# EasyEDA Pro project 智能视觉母版_V2.eprj, schematic 原理图_V2
Create Date: 2023-11-26; Page Name: P1; Project Name: 智能视觉母版_V2; Schematic Name: 原理图_V2; Update Date: 2023-11-29; Company: 嘉立创EDA; Page Size: A3; Version: V1.0
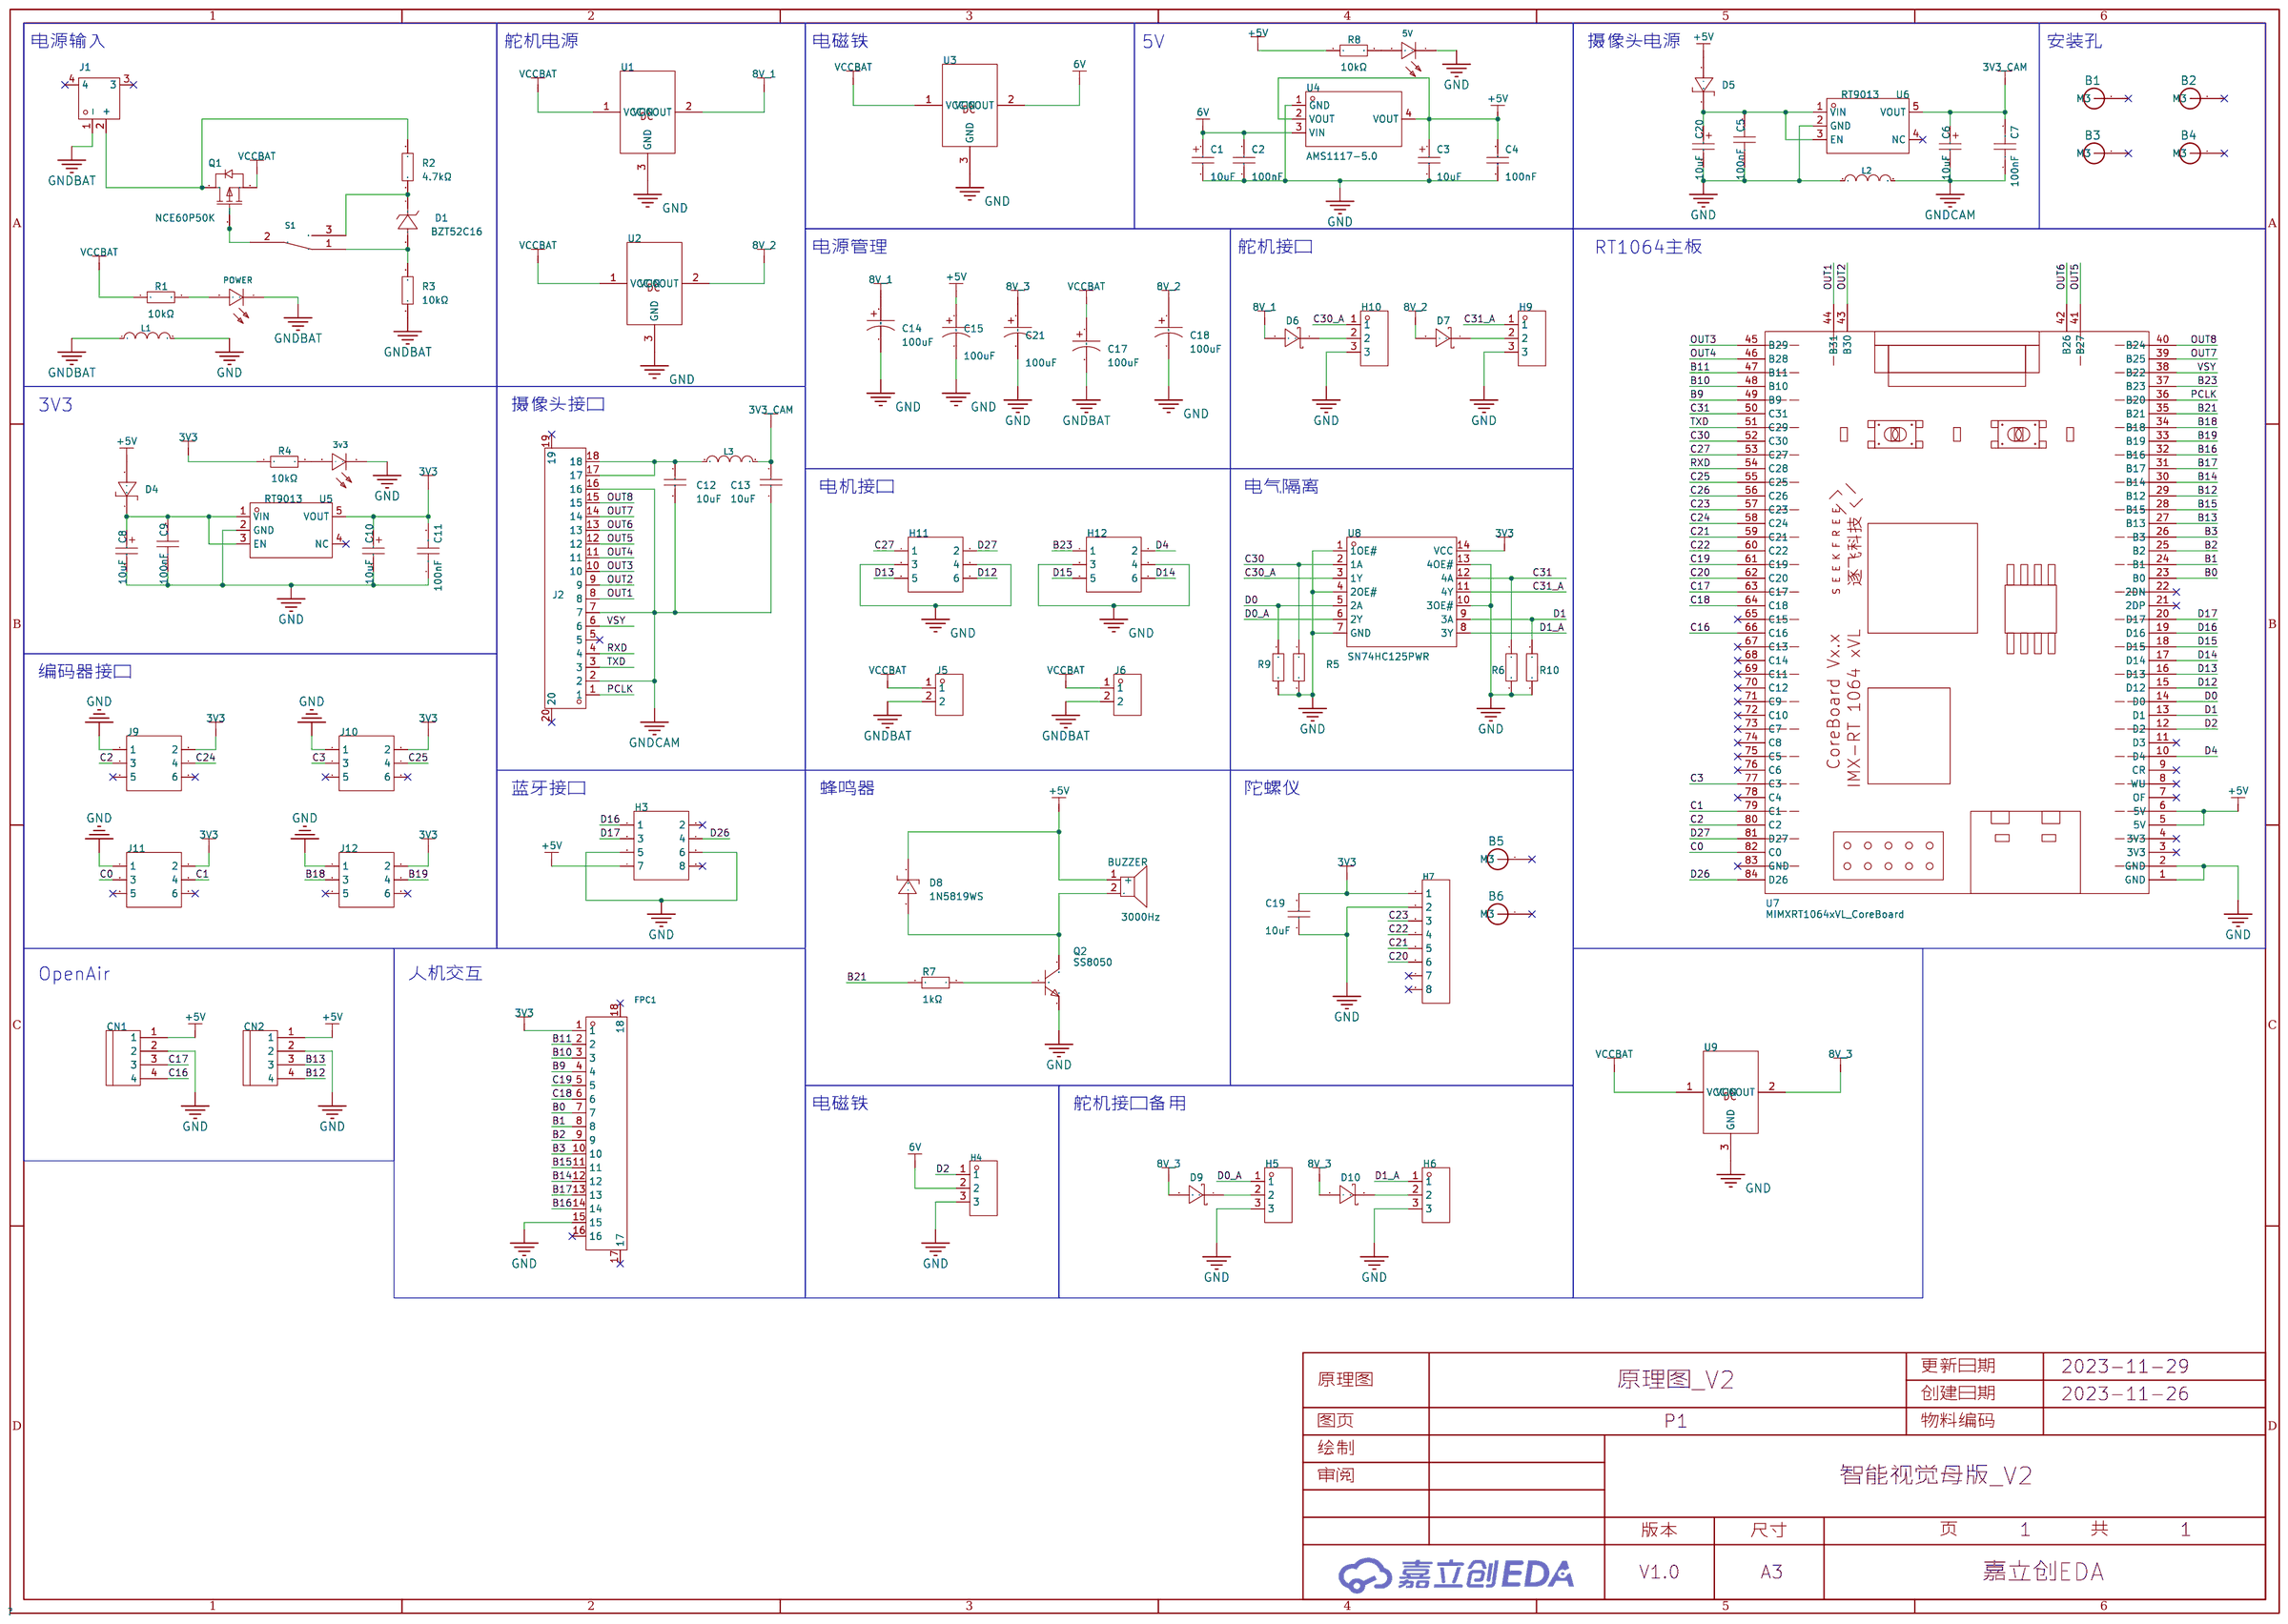
[diagram p0: schematic sheet]

## Parts
3v3  NCD0603W1  [LED0603-RD]
5V  NCD0603W1  [LED0603-RD]
B1  M3螺柱孔_JX  [M3]
B2  M3螺柱孔_JX  [M3]
B3  M3螺柱孔_JX  [M3]
B4  M3螺柱孔_JX  [M3]
B5  M3螺柱孔_JX  [M3]
B6  M3螺柱孔_JX  [M3]
BUZZER  3000Hz  [BUZ-TH_BD9.6-P5.00-D0.7-FD]
C1  10uF  [CAP-SMD_L3.2-W1.6-RD-C7171]
C2  100nF  [C0603]
C3  10uF  [CAP-SMD_L3.2-W1.6-RD-C7171]
C4  100nF  [C0603]
C5  100nF  [C0603]
C6  10uF  [CASE-A_3216]
C7  100nF  [C0603]
C8  10uF  [CASE-A_3216]
C9  100nF  [C0603]
C10  10uF  [CASE-A_3216]
C11  100nF  [C0603]
C12  10uF  [C0805]
C13  10uF  [C0805]
C14  100uF  [CAP-TH_BD8.0-P3.50-D0.6-FD]
C15  100uF  [CAP-TH_BD8.0-P3.50-D0.6-FD]
C17  100uF  [CAP-TH_BD8.0-P3.50-D0.6-FD]
C18  100uF  [CAP-TH_BD8.0-P3.50-D0.6-FD]
C19  10uF  [C0805]
C20  10uF  [CASE-A_3216]
C21  100uF  [CAP-TH_BD8.0-P3.50-D0.6-FD]
CN1  XH-4AW  [CONN-TH_XH2.54-4AW]
CN2  XH-4AW  [CONN-TH_XH2.54-4AW]
D1  BZT52C16  [SOD-123_L2.7-W1.6-LS3.7-RD]
D4  1N5819WS  [SOD-323_L1.8-W1.3-LS2.5-RD]
D5  1N5819WS  [SOD-323_L1.8-W1.3-LS2.5-RD]
D6  1N5819W  [SOD-123_L2.8-W1.8-LS3.7-RD]
D7  1N5819W  [SOD-123_L2.8-W1.8-LS3.7-RD]
D8  1N5819WS  [SOD-323_L1.8-W1.3-LS2.5-RD]
D9  1N5819W  [SOD-123_L2.8-W1.8-LS3.7-RD]
D10  1N5819W  [SOD-123_L2.8-W1.8-LS3.7-RD]
FPC1  FPC-05F-16PH20  [FPC-SMD_16P-P0.50_FPC-05F-16PH20]
H3  -  [HDR-TH_8P-P2.54-V-F-R2-C4-S2.54-1]
H4  -  [HDR-TH_3P-P2.54-V-F]
H5  -  [HDR-TH_3P-P2.54-V-M]
H6  -  [HDR-TH_3P-P2.54-V-M]
H7  -  [HDR-TH_8P-P2.54-V-F-1]
H9  -  [HDR-TH_3P-P2.54-V-M]
H10  -  [HDR-TH_3P-P2.54-V-M]
H11  -  [HDR-TH_6P-P2.54-V-R2-C3-S2.54_A2541WV-2X3P]
H12  -  [HDR-TH_6P-P2.54-V-R2-C3-S2.54_A2541WV-2X3P]
J1  XT60PW-M  [CONN-TH_XT60PW-M]
J2  J2  [FPC-SMD_18P-P0.50_FPC-05F-18PH20]
J5  KF301-5.0-2P  [CONN-TH_P5.00_KF301-5.0-2P]
J6  KF301-5.0-2P  [CONN-TH_P5.00_KF301-5.0-2P]
J9  -  [HDR-TH_6P-P2.54-V-R2-C3-S2.54_A2541WV-2X3P]
J10  -  [HDR-TH_6P-P2.54-V-R2-C3-S2.54_A2541WV-2X3P]
J11  -  [HDR-TH_6P-P2.54-V-R2-C3-S2.54_A2541WV-2X3P]
J12  -  [HDR-TH_6P-P2.54-V-R2-C3-S2.54_A2541WV-2X3P]
L1  CBG201209U000T  [L0805]
L2  CBG201209U000T  [L0805]
L3  CBG201209U000T  [L0805]
POWER  NCD0603R1  [LED0603-RD_RED]
Q1  NCE60P50K  [TO-252-2_L6.6-W6.1-P4.57-LS9.9-TL-CW]
Q2  SS8050  [SOT-23-3_L2.9-W1.3-P1.90-LS2.4-BR]
R1  10kΩ  [R0603]
R2  4.7kΩ  [R0603]
R3  10kΩ  [R0603]
R4  10kΩ  [R0603]
R5  10kΩ  [R0603]
R6  10kΩ  [R0603]
R7  1kΩ  [R0603]
R8  10kΩ  [R0603]
R9  10kΩ  [R0603]
R10  10kΩ  [R0603]
S1  MT-0-102-A101-M200-RS  [SW-TH_MT-0-103-A101-M200-RS]  (no BOM)
U1  -  [DC_Board]  (no BOM)
U2  -  [DC_Board]  (no BOM)
U3  -  [DC_Board]  (no BOM)
U4  AMS1117-5.0  [SOT-223_L6.5-W3.5-P2.30-LS7.0-BR]
U5  RT9013  [SOT-23-5_L2.9-W1.6-P0.95-LS2.8-BR]
U6  RT9013  [SOT-23-5_L2.9-W1.6-P0.95-LS2.8-BR]
U7  MIMXRT1064xVL_CoreBoard  [MIMXRT1064xVL_CoreBoard - 3D]
U8  SN74HC125PWR  [TSSOP-14_L5.0-W4.4-P0.65-LS6.5-BL]
U9  -  [DC_Board]  (no BOM)

## Library data of the parts
3v3 5V = NCD0603W1: 发光颜色:白灯;; LCSC Part Name: 白灯 0603白灯   正贴; Supplier Part: C84265; Manufacturer: 国星光电; Supplier Footprint: 0603; JLCPCB Part Class: Extended Part; Datasheet: https://atta.szlcsc.com/upload/public/pdf/source/20200820/C84265_479E6193713348A548E5CD6D9278BF16.pdf; Supplier: LCSC; Emitted Color: 白灯
B1-B6 = M3螺柱孔_JX
BUZZER = HNB09A05: 驱动方式:有源(内含驱动线路);构造类型:电磁式;额定电压:5V;工作电压:4V~8V;频率:3000Hz;声压(SPL):85dB@5V,10cm;直径(φD):9mm;高度:5.7mm;; Supplier Part: C96493; Manufacturer: 华能; Supplier Footprint: 插件; JLCPCB Part Class: 扩展库; Datasheet: https://atta.szlcsc.com/upload/public/pdf/source/20170522/1495448327549.pdf; Supplier: LCSC; Oscillator Circuit: 有源(内含驱动线路); Technology Type: 电磁式; Rated Voltage: 5V; Operating Voltage: 4V~8V; Sound Pressure Level (SPL): 85dB@5V,10cm; Diameter (φD): 9mm; Height: 5.7mm
C1 C3 = TAJA106K016RNJ: 容值:10uF;精度:±10%;额定电压:16V;等效串联电阻:3Ω@100kHz;; LCSC Part Name: 10uF ±10% 16V; Supplier Part: C7171; Manufacturer: Kyocera AVX; Supplier Footprint: CASE-A-3216; JLCPCB Part Class: 基础库; Datasheet: https://atta.szlcsc.com/upload/public/pdf/source/20160107/1457707748093.pdf; Supplier: LCSC; Tolerance: ±10%; Rated Voltage: 16V; Equivalent Series Resistance(ESR): 3Ω@100kHz; Operating Temperature: -55℃~+125℃
C2 C4 = 0603B104K500NT: 容值:100nF;精度:±10%;额定电压:50V;材质(温度系数):X7R;; LCSC Part Name: 100nF ±10% 50V; Supplier Part: C30926; Manufacturer: FH(风华); Supplier Footprint: 0603; JLCPCB Part Class: Extended Part; Datasheet: https://atta.szlcsc.com/upload/public/pdf/source/20170923/C30926_1506149436298988724.pdf; Supplier: LCSC; Tolerance: ±10%; Voltage Rated: 50V; Temperature Coefficient: X7R
C5 C7 C9 C11 = CAP_0603: Supplier Footprint: 0603
C6 C8 C10 C20 = CA45-A-10V-10uF-M: 容值:10uF;精度:±20%;额定电压:10V;等效串联电阻:8Ω@100kHz;工作温度:-55~+125;; LCSC Part Name: 10uF ±20% 10V; Supplier Part: C128256; Manufacturer: CEC(振华新云); JLCPCB Part Class: Extended Part; Datasheet: https://atta.szlcsc.com/upload/public/pdf/source/20171113/C128256_15105610660201115413.pdf; Supplier: LCSC; Tolerance: ±20%; Rated Voltage: 10V; Equivalent Series Resistance(ESR): 8Ω@100kHz; Operating Temperature: -55~+125
C12 C13 C19 = CL21A106KAYNNNE_C15850: 容值:10uF;精度:±10%;额定电压:25V;材质(温度系数):X5R;; LCSC Part Name: 10uF ±10% 25V; Supplier Part: C15850; Manufacturer: SAMSUNG(三星); Manufacturer Part: CL21A106KAYNNNE; Supplier Footprint: 0805; JLCPCB Part Class: 基础库; Datasheet: https://atta.szlcsc.com/upload/public/pdf/source/20160103/1457707679302.pdf; Supplier: LCSC; Tolerance: ±10%; Voltage Rated: 25V; Temperature Coefficient: X5R
C14 C15 C17 C18 C21 = 25PZE220M8X9: 类型:混合物;容值:220uF;精度:±20%;额定电压:25V;电容体直径:8mm;电容体长度:9mm;脚间距:-;纹波电流:2.3A@100kHz;等效串联电阻:27mΩ@100kHz;工作寿命:10000hrs@105℃;工作温度:-55℃~+105℃;; LCSC Part Name: 220uF ±20% 25V; Supplier Part: C1578758; Manufacturer: rubycon(红宝石); Supplier Footprint: 径向引线,8x9mm; JLCPCB Part Class: Extended Part; Datasheet: https://atta.szlcsc.com/upload/public/pdf/source/20210510/C1578758_E2F1F56A0A42A1F170EC582F74BCA115.pdf; Supplier: LCSC; Type: 混合物; Tolerance: ±20%; Rated Voltage: 25V; φD: 8mm; L: 9mm; Ripple Current: 2.3A@100kHz; Equivalent Series Resistance(ESR): 27mΩ@100kHz; Lifetime @ Temp: 10000hrs@105℃; Operating Temperature: -55℃~+105℃
CN1 CN2 = XH-4AW_C21273: 参考系列:XH;间距:2.5mm;插针结构:1x4P;排数:1;每排PIN数:4;行距:-;安装方式:-;触头材质:磷青铜;; LCSC Part Name: 系列:XH 间距:2.5mm 1x4P 卧插; Supplier Part: C21273; Manufacturer: BOOMELE(博穆精密); Supplier Footprint: 弯插,P=2.5mm; JLCPCB Part Class: Extended Part; Datasheet: https://atta.szlcsc.com/upload/public/pdf/source/20181205/C146112_2CB31444E6250AC61E2A41A9A8391D5F.pdf; Supplier: LCSC; Reference Series: XH; Pitch: 2.5mm; Pins Structure: 1x4P; Number of Rows: 1; Number of PINs Per Row: 4; Contact Material: 磷青铜
D1 = BZT52C16: 稳压值(标称值):-;精度:-;功率:500mW;反向电流(Ir):100nA@11.2V;; LCSC Part Name: 500mW; Supplier Part: C707145; Manufacturer: Slkor(萨科微); Supplier Footprint: SOD-123; JLCPCB Part Class: 扩展库; Datasheet: https://atta.szlcsc.com/upload/public/pdf/source/20200721/C707125_BAEA70ACC1B0F60BBAC1FD71D8806D24.pdf; Supplier: LCSC; Power Dissipation: 500mW; Reverse Leakage Current (Ir): 100nA@11.2V
D4 D5 D8 = 1N5819WS_C191023: 直流反向耐压(Vr):40V;平均整流电流(Io):1A;正向压降(Vf):600mV@1A;; LCSC Part Name: 40V 1A 600mV@1A; Supplier Part: C191023; Manufacturer: Hottech(合科泰); Supplier Footprint: SOD-323; JLCPCB Part Class: 基础库; Datasheet: https://atta.szlcsc.com/upload/public/pdf/source/20220428/3CB86FD8D28D653594B4E35F9D5AEFD9.pdf; Supplier: LCSC; Reverse Voltage (Vr): 40V; Average Rectified Current (Io): 1A; Forward Voltage (Vf@If): 600mV@1A
D6 D7 D9 D10 = 1N5819W_C369930: 正向压降(Vf):600mV@1A;直流反向耐压(Vr):40V;平均整流电流(Io):1A;; LCSC Part Name: 电压:40V 电流:1A; Supplier Part: C369930; Manufacturer: KEXIN(科信); Supplier Footprint: SOD-123FL; JLCPCB Part Class: Extended Part; Datasheet: https://atta.szlcsc.com/upload/public/pdf/source/20190226/C369930_913B46064935EAA2DC128976F7CDE656.pdf; Supplier: LCSC; Forward Voltage (Vf@If): 600mV@1A; Reverse Voltage (Vr): 40V; Average Rectified Current (Io): 1A
FPC1 = FPC-05F-16PH20: 间距:0.5mm;触点数量:16P;锁定特性:翻盖式;安装类型:卧贴;触点类型:下接;工作温度范围:-25℃~+85℃;; LCSC Part Name: 0.5mm P数:16P 翻盖式 下接; Supplier Part: C2856801; Manufacturer: XUNPU(讯普); Supplier Footprint: SMD,P=0.5mm; JLCPCB Part Class: Extended Part; Datasheet: https://atta.szlcsc.com/upload/public/pdf/source/20210922/C2856801_73A554E58C5577257FCEC843978D3BA6.pdf; Supplier: LCSC; Pitch: 0.5mm; Number of Contacts: 16P; Locking Feature: 翻盖式; Mounting Type: 卧贴; Contact Type: 下接; Height Above Board: 2mm; FFC, FCB Thickness: 0.3mm; Operating Temperature Range: -25℃~+85℃
H3 = HDR-F_2.54_2x4: Supplier Part: C92271; Supplier Footprint: 插件
H4 = HDR-F_2.54_1x3P: Supplier Part: C541850; Supplier Footprint: 插件
H5 H6 H9 H10 = HDR-M_2.54_1x3P: Supplier Part: C2937625; Supplier Footprint: 插件
H7 = HDR-F_2.54_1x8P: Supplier Part: C27438; Supplier Footprint: 插件
H11 H12 J9-J12 = HDR-M_2.54_2x3: Supplier Part: C402781; Supplier Footprint: 插件,P=2.54mm
J1 = XT60PW-M: 模型锂电连接器; LCSC Part Name: AMASS(艾迈斯)航模插头xt90连接器150公母对接pw锂电池公头 板插卧式XT60PW-M; Supplier Part: C98732; Manufacturer: AMASS(艾迈斯); JLCPCB Part Class: 扩展库; Datasheet: https://atta.szlcsc.com/upload/public/pdf/source/20180125/C98732_15168617837851301983.pdf; Supplier: LCSC
J2 = FPC-05F-18PH20: 间距:0.5mm;触点数量:18P;锁定特性:翻盖式;安装类型:卧贴;触点类型:下接;工作温度范围:-25℃~+85℃;; LCSC Part Name: 0.5mm P数:18P 翻盖式 下接; Supplier Part: C2856802; Manufacturer: XUNPU(讯普); Supplier Footprint: SMD,P=0.5mm; JLCPCB Part Class: Extended Part; Datasheet: https://atta.szlcsc.com/upload/public/pdf/source/20210922/C2856802_2A845D1961F33AEC1ED22CECB292335F.pdf; Supplier: LCSC; Pitch: 0.5mm; Number of Contacts: 18P; Locking Feature: 翻盖式; Mounting Type: 卧贴; Contact Type: 下接; Height Above Board: 2mm; FFC, FCB Thickness: 0.3mm; Operating Temperature Range: -25℃~+85℃
J5 J6 = KF301-5.0-2P: 间距:5mm;排数:1;每排PIN数:2;安装方式:直针;额定电流:17A;额定电压:250V;线规 - AWG:14~22;线规 - mm?:1.5;工作温度范围:-30℃~+120℃;颜色:蓝色;; LCSC Part Name: 5mm 排数:1 每排P数:2 直针 可拼接 铜 环保; Supplier Part: C474881; Manufacturer: KEFA(科发); Supplier Footprint: 直插,P=5mm; JLCPCB Part Class: Extended Part; Datasheet: https://atta.szlcsc.com/upload/public/pdf/source/20200115/C474881_883EFE2003339C40FD1BEEEFC9A18423.pdf; Supplier: LCSC; Pitch: 5mm; Number of Rows: 1; Number of PINs Per Row: 2; Mounting Style: 直针; Current Rating (Max): 17A; Voltage Rating (Max): 250V; Wire Gauge - AWG: 14~22; Wire Gauge - mm?: 1.5; Operating Temperature Range: -30℃~+120℃; Color: 蓝色
L1-L3 = CBG201209U000T: 标称阻抗@测试频率:0Ω@100MHz;直流电阻(RDC):80mΩ;; LCSC Part Name: 单路 0805磁珠 阻抗0Ω@100MHz; Supplier Part: C91037; Manufacturer: FH(风华); Supplier Footprint: 0805; JLCPCB Part Class: 扩展库; Datasheet: https://atta.szlcsc.com/upload/public/pdf/source/20161217/1481939213023.pdf; Supplier: LCSC; Impedance @ Frequency: 0Ω@100MHz; DC Resistance: 80mΩ; Current Rating: 900mA; Circuits: 1
POWER = NCD0603R1_C84263: 发光颜色:红灯;; LCSC Part Name: 红灯 0603红灯   正贴; Supplier Part: C84263; Manufacturer: 国星光电; Supplier Footprint: 0603; JLCPCB Part Class: Extended Part; Datasheet: https://atta.szlcsc.com/upload/public/pdf/source/20200820/C84263_DABC6A75E58F576973B407FDBA283D60.pdf; Supplier: LCSC; Emitted Color: 红灯
Q1 = NCE60P50K: 类型:P沟道;漏源电压(Vdss):60V;连续漏极电流(Id):50A;功率(Pd):95W;导通电阻(RDS(on)@Vgs,Id):23mΩ@10V,20A;阈值电压(Vgs(th)@Id):3.5V@250uA;; LCSC Part Name: P沟道 60V 50A; Supplier Part: C130104; Manufacturer: NCE(无锡新洁能); Supplier Footprint: TO-252-2(DPAK); JLCPCB Part Class: 扩展库; Datasheet: https://atta.szlcsc.com/upload/public/pdf/source/20170919/C130104_1505787180031976877.pdf; Supplier: LCSC; Type: P沟道; Drain Source Voltage (Vdss): 60V; Continuous Drain Current (Id): 50A; Power Dissipation (Pd): 95W; Drain Source On Resistance (RDS(on)@Vgs,Id): 23mΩ@10V,20A; Gate Threshold Voltage (Vgs(th)@Id): 3.5V@250uA
Q2 = SS8050_C2150: 晶体管类型:NPN;集射极击穿电压(Vceo):25V;集电极电流(Ic):1.5A;功率(Pd):300mW;直流电流增益(hFE@Ic,Vce):200@100mA,1V;; LCSC Part Name: NPN 25V 1.5A Y1 200-350; Supplier Part: C2150; Manufacturer: CJ(江苏长电/长晶); Supplier Footprint: SOT-23; JLCPCB Part Class: 基础库; Datasheet: https://atta.szlcsc.com/upload/public/pdf/source/20230322/AEE86F4B043774EFF80CAEA14A37D9E9.pdf; Supplier: LCSC; Transistor Type: NPN; Collector-Emitter Breakdown Voltage (Vceo): 25V; Collector Current (Ic): 1.5A; Power Dissipation (Pd): 300mW; Collector Cut-Off Current (Icbo): 100nA; Collector-Emitter Saturation Voltage (VCE(sat)@Ic,Ib): 500mV@800mA,80mA; DC Current Gain (hFE@Ic,Vce): 200@100mA,1V; Transition Frequency (fT): 100MHz; Operating Temperature: +150℃@(Tj)
R1 R3-R6 R8-R10 = 0603WAF1002T5E: 电阻类型:厚膜电阻;阻值:10kΩ;精度:±1%;功率:100mW;; LCSC Part Name: 厚膜电阻 10kΩ ±1% 100mW; Supplier Part: C25804; Manufacturer: UNI-ROYAL(厚声); Supplier Footprint: 0603; JLCPCB Part Class: 基础库; Datasheet: https://atta.szlcsc.com/upload/public/pdf/source/20200306/C422600_1E6D84923E4A46A82E41ADD87F860B5C.pdf; Supplier: LCSC; Type: 厚膜电阻; Tolerance: ±1%; Power(Watts): 100mW; Temperature Coefficient: ±100ppm/℃; Overload Voltage (Max): 75V; Operating Temperature Range: -55℃~+155℃
R2 = 0603WAF4701T5E: 电阻类型:厚膜电阻;阻值:4.7kΩ;精度:±1%;功率:100mW;; LCSC Part Name: 4.7kΩ ±1% 100mW; Supplier Part: C23162; Manufacturer: UNI-ROYAL(厚声); Supplier Footprint: 0603; JLCPCB Part Class: Basic Part; Datasheet: https://atta.szlcsc.com/upload/public/pdf/source/20200306/C422600_1E6D84923E4A46A82E41ADD87F860B5C.pdf; Supplier: LCSC; Type: 厚膜电阻; Tolerance: ±1%; Power(Watts): 100mW; Temperature Coefficient: ±100ppm/℃; Overload Voltage (Max): 75V; Operating Temperature Range: -55℃~+155℃
R7 = 0603WAF1001T5E: 电阻类型:厚膜电阻;阻值:1kΩ;精度:±1%;功率:100mW;; LCSC Part Name: 1kΩ ±1% 100mW; Supplier Part: C21190; Manufacturer: UNI-ROYAL(厚声); Supplier Footprint: 0603; JLCPCB Part Class: Basic Part; Datasheet: https://atta.szlcsc.com/upload/public/pdf/source/20200306/C422600_1E6D84923E4A46A82E41ADD87F860B5C.pdf; Supplier: LCSC; Type: 厚膜电阻; Tolerance: ±1%; Power(Watts): 100mW; Temperature Coefficient: ±100ppm/℃; Overload Voltage (Max): 75V; Operating Temperature Range: -55℃~+155℃
S1 = MT-0-102-A101-M200-RS: 额定电流:5A;额定电压(AC):125V;电路结构:单刀双掷;机械寿命:-;安装方式:直插;; LCSC Part Name: 小型钮子三脚二档 二件套 含配件; Supplier Part: C1788492; Manufacturer: YUEN FUNG(源丰); Supplier Footprint: 插件; JLCPCB Part Class: 扩展库; Datasheet: https://atta.szlcsc.com/upload/public/pdf/source/20230720/8E5C36EFDF374AE4FF4AC09DB233CE0E.pdf; Supplier: LCSC; Contact Current: 5A; Voltage Rating (AC): 125V; Circuit: 单刀双掷; Actuator Type: 圆柱钮柄; Pin Style: 焊片; Mounting Style: 直插; Operating Temperature: -25℃~+85℃; Switch Length: 13mm; Switch Width: 8mm; Switch Height: 28.6mm
U1-U3 U9 = DC_Board
U4 = AMS1117-5.0_C6187: 输出类型:固定;最大输入电压:12V;输出电压:5V;输出电流:1A;电源纹波抑制比(PSRR):68dB@(120Hz);输出极性:正;; LCSC Part Name: 输入12V 输出5V 1A; Supplier Part: C6187; Manufacturer: AMS; Supplier Footprint: SOT-223; JLCPCB Part Class: 基础库; Datasheet: https://atta.szlcsc.com/upload/public/pdf/source/20230918/E4B716057EE82179D88E8A0894830D59.pdf; Supplier: LCSC; Output Type: 固定; Maximum Input Voltage: 12V; Output Voltage: 5V; Output Current: 1A; Power Supply Rejection Ratio (PSRR): 68dB@(120Hz); Dropout Voltage: 1.3V@(1A); Output Polarity: 正; Number of Outputs: 1
U5 U6 = RT9013-30GB: LCSC Part Name: CMOS LDO Regulator; Supplier Part: C3031664; Manufacturer: RICHTEK(台湾立锜); Supplier Footprint: SOT-23-5; Datasheet: https://atta.szlcsc.com/upload/public/pdf/source/20151126/1457707591671.pdf; Supplier: LCSC
U7 = MIMXRT1064xVL_CoreBoard
U8 = SN74HC125PWR: 类型:缓冲器，非反相;电源电压:2V~6V;输入类型:-;输出类型:三态;低电平输出电流(IOL):7.8mA;高电平输出电流(IOH):7.8mA;工作温度:-40℃~+85℃;; Supplier Part: C132994; Manufacturer: TI(德州仪器); Supplier Footprint: TSSOP-14; JLCPCB Part Class: Extended Part; Datasheet: https://atta.szlcsc.com/upload/public/pdf/source/20170930/C132994_1506736365150997346.pdf; Supplier: LCSC; Type: 缓冲器，非反相; Supply Voltage: 2V~6V; output type: 三态; Current-OutputLow: 7.8mA; Current-OutputHigh: 7.8mA; Operating temperature: -40℃~+85℃

## Nets
3V3: C10.1 C11.2 C19.2 FPC1.1 H7.1 J9.2 J10.2 J11.2 J12.2 R4.1 U5.5(VOUT) U8.14(VCC)
3V3_CAM: C6.1 C7.2 C13.2 L3.2 U6.5(VOUT)
6V: C1.1 C2.2 H4.2 U3.2(VCCOUT) U4.3(VIN)
8V_1: C14.1 D6.2(A) U1.2(VCCOUT)
8V_2: C18.1 D7.2(A) U2.2(VCCOUT)
8V_3: C21.1 D9.2(A) D10.2(A) U9.2(VCCOUT)
+5V: BUZZER.1(+) C3.1 C4.2 C15.1 CN1.1 CN2.1 D4.2(A) D5.2(A) D8.1(C) H3.7 R8.1 U4.2(VOUT) U4.4(VOUT) U7.5(5V) U7.6(5V)
GND: 3v3.1(-) 5V.1(-) C1.2 C2.1 C3.2 C4.1 C5.1 C8.2 C9.1 C10.2 C11.1 C14.2 C15.2 C18.2 C19.1 C20.2 C21.2 CN1.2 CN2.2 FPC1.15 H3.5 H3.6 H4.3 H5.3 H6.3 H7.2 H9.3 H10.3 H11.3 H11.4 H12.3 H12.4 J9.1 J10.1 J11.1 J12.1 L1.2 L2.1 Q2.2(E) R5.2 R6.2 R9.2 R10.2 U1.3(GND) U2.3(GND) U3.3(GND) U4.1(GND) U5.2(GND) U6.2(GND) U7.1(GND) U7.2(GND) U8.1(1OE#) U8.4(2OE#) U8.7(GND) U8.10(3OE#) U8.13(4OE#) U9.3(GND)
GNDBAT: C17.2 J1.1(-) J5.2 J6.2 L1.1 POWER.1(K) R3.2
GNDCAM: C6.2 C7.1 C12.1 C13.1 J2.2 J2.7 J2.16 L2.2
VCCBAT: C17.1 J5.1 J6.1 Q1.2(D) R1.1 U1.1(VCCIN) U2.1(VCCIN) U3.1(VCCIN) U9.1(VCCIN)
B0: FPC1.7 U7.23(B0)
B1: FPC1.8 U7.24(B1)
B2: FPC1.9 U7.25(B2)
B3: FPC1.10 U7.26(B3)
B9: FPC1.4 U7.49(B9)
B10: FPC1.3 U7.48(B10)
B11: FPC1.2 U7.47(B11)
B12: CN2.4 U7.29(B12)
B13: CN2.3 U7.27(B13)
B14: FPC1.12 U7.30(B14)
B15: FPC1.11 U7.28(B15)
B16: FPC1.14 U7.32(B16)
B17: FPC1.13 U7.31(B17)
B18: J12.3 U7.34(B18)
B19: J12.4 U7.33(B19)
B21: R7.1 U7.35(B21)
B23: H12.1 U7.37(B23)
C0: J11.3 U7.82(C0)
C1: J11.4 U7.79(C1)
C2: J9.3 U7.80(C2)
C3: J10.3 U7.77(C3)
C16: CN1.4 U7.66(C16)
C17: CN1.3 U7.63(C17)
C18: FPC1.6 U7.64(C18)
C19: FPC1.5 U7.61(C19)
C20: H7.6 U7.62(C20)
C21: H7.5 U7.59(C21)
C22: H7.4 U7.60(C22)
C23: H7.3 U7.57(C23)
C24: J9.4 U7.58(C24)
C25: J10.4 U7.55(C25)
C26: U7.56(C26)
C27: H11.1 U7.53(C27)
C30: R5.1 U7.52(C30) U8.2(1A)
C30_A: H10.1 U8.3(1Y)
C31: R6.1 U7.50(C31) U8.12(4A)
C31_A: H9.1 U8.11(4Y)
D0: R9.1 U7.14(D0) U8.5(2A)
D0_A: H5.1 U8.6(2Y)
D1: R10.1 U7.13(D1) U8.9(3A)
D1_A: H6.1 U8.8(3Y)
D2: H4.1 U7.12(D2)
D4: H12.2 U7.10(D4)
D12: H11.6 U7.15(D12)
D13: H11.5 U7.16(D13)
D14: H12.6 U7.17(D14)
D15: H12.5 U7.18(D15)
D16: H3.1 U7.19(D16)
D17: H3.3 U7.20(D17)
D26: H3.4 U7.84(D26)
D27: H11.2 U7.81(D27)
OUT1: J2.8 U7.44(B31)
OUT2: J2.9 U7.43(B30)
OUT3: J2.10 U7.45(B29)
OUT4: J2.11 U7.46(B28)
OUT5: J2.12 U7.41(B27)
OUT6: J2.13 U7.42(B26)
OUT7: J2.14 U7.39(B25)
OUT8: J2.15 U7.40(B24)
PCLK: J2.1 U7.36(B20)
RXD: J2.4 U7.54(C28)
TXD: J2.3 U7.51(C29)
VSY: J2.6 U7.38(B22)
$1N607: D1.1(K) R2.1 S1.3
$1N608: D1.2(A) R3.1 S1.1
$1N609: J1.2(+) Q1.3(S) R2.2
$1N610: Q1.1(G) S1.2
$1N613: POWER.2(A) R1.2
$1N2073: C8.1 C9.2 D4.1(C) U5.1(VIN) U5.3(EN)
$1N2078: 3v3.2(+) R4.2
$1N2664: C5.2 C20.1 D5.1(C) U6.1(VIN) U6.3(EN)
$1N3907: C12.2 J2.17 J2.18 L3.1
$1N4591: D6.1(K) H10.2
$1N4675: D7.1(K) H9.2
$1N6084: Q2.1(B) R7.2
$1N6086: BUZZER.2 D8.2(A) Q2.3(C)
$1N7130: 5V.2(+) R8.2
$1N11056: D9.1(K) H5.2
$1N11061: D10.1(K) H6.2

Not connected (* = marked no-connect by the designer): B1 1(M3)*; B2 1(M3)*; B3 1(M3)*; B4 1(M3)*; B5 1(M3)*; B6 1(M3)*; FPC1 16* 17* 18*; H3 2* 8*; H7 7* 8*; J1 3* 4*; J2 5* 19* 20*; J9 5* 6*; J10 5* 6*; J11 5* 6*; J12 5* 6*; U5 4(NC)*; U6 4(NC)*; U7 3(3V3)* 4(3V3)* 7(OF)* 8(WU)* 9(CR)* 11(D3)* 21(2DP)* 22(2DN)* 65(C15)* 67(C13)* 68(C14)* 69(C11)* 70(C12)* 71(C9)* 72(C10)* 73(C7)* 74(C8)* 75(C5)* 76(C6)* 78(C4)* 83(GND)*

## Notes on the sheet
- 电源输入
- 舵机电源
- 电磁铁
- 5V
- 摄像头电源
- 安装孔
- 电源管理
- 舵机接口
- RT1064主板
- 3V3
- 摄像头接口
- 电机接口
- 电气隔离
- 编码器接口
- 蓝牙接口
- 蜂鸣器
- 陀螺仪
- OpenAir
- 人机交互
- 电磁铁
- 舵机接口备用
